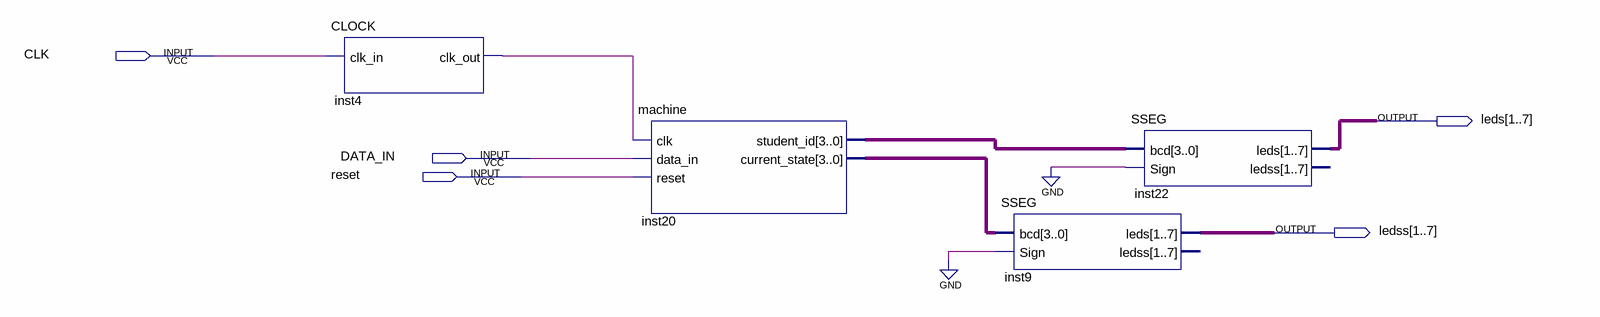
[diagram p0: schematic sheet]
// Quartus schematic FSMBlock.bdf as structural Verilog: 4 symbols, 5 pins
module FSMBlock (
  input  CLK,
  input  DATA_IN,
  input  reset,
  output [1:7] leds,
  output [1:7] ledss
);

  wire inst4_clk_out;
  wire [3:0] inst20_current_state, inst20_student_id;

  CLOCK inst4 (.clk_in(CLK), .clk_out(inst4_clk_out));
  machine inst20 (
    .clk(inst4_clk_out), .data_in(DATA_IN), .reset(reset), .student_id(inst20_student_id),
    .current_state(inst20_current_state));
  SSEG inst9 (.bcd(inst20_current_state), .Sign(1'b0), .leds(ledss));  // open: ledss
  SSEG inst22 (.bcd(inst20_student_id), .Sign(1'b0), .leds(leds));  // open: ledss
endmodule
